# EasyEDA schematic SCH_Research-Project_2024-03-13.json
TITLE: Prototype circuits; REV: 1.0; Date: 2024-03-13; Sheet: 1/1; Drawn By: Simone; Company: Unitn
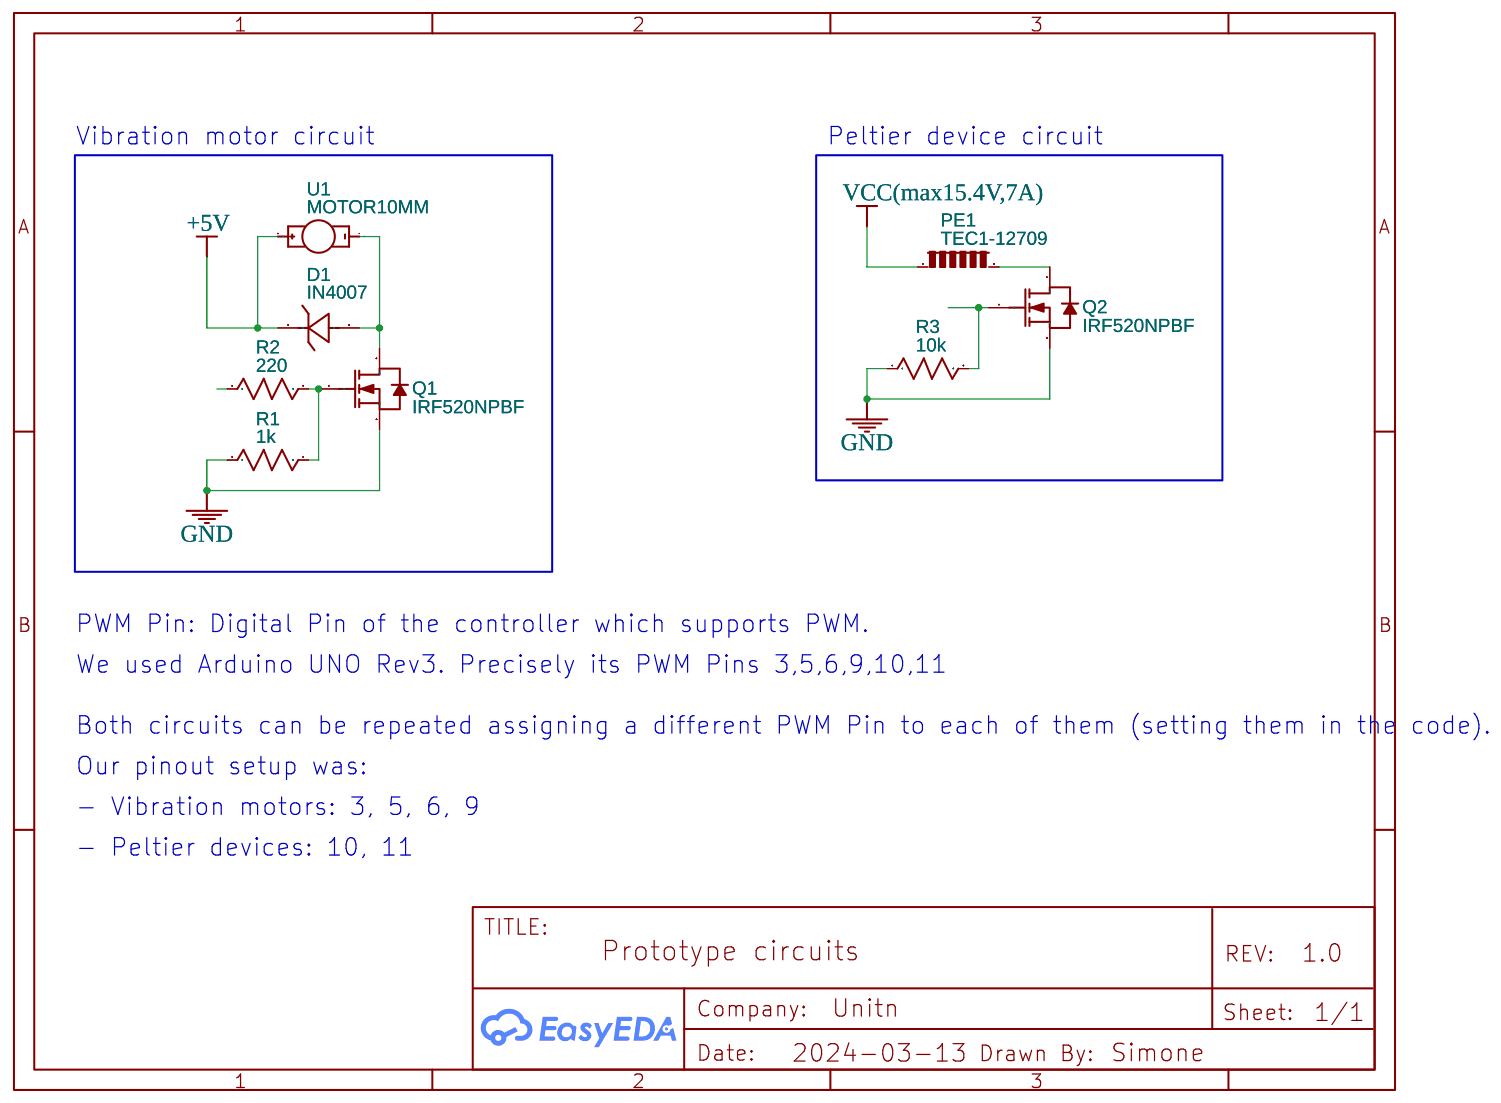
[diagram p0: schematic sheet]

## Parts
D1  IN4007  [SMA_L4.3-W2.6-LS5.1-RD]
PE1  TEC1-12709
Q1  IRF520NPBF  [TO-220-3_L10.0-W4.5-P2.54-T]
Q2  IRF520NPBF  [TO-220-3_L10.0-W4.5-P2.54-T]
R1  1k  [R0603]
R2  220  [R0603]
R3  10k  [R0603]
U1  MOTOR10MM  [VIBE-MOTOR-10MM]

## Library data of the parts
D1 = IN4007: Contributor: LCSC; Supplier: LCSC; Supplier Part: C9900004719; JLCPCB Part Class: Extended Part; Manufacturer: null
PE1 = Peltier_Element: Contributor: KiCAD; license: https://www.gnu.org/licenses/lgpl-2.1.html
Q1 Q2 = IRF520NPBF: Supplier: LCSC; Manufacturer: Infineon(英飞凌); Supplier Part: C2598; JLCPCB Part Class: Extended Part
R1-R3 = R_0603_US: Contributor: LCEDA_Lib
U1 = MOTOR10MM: Vibration Motor- ROB-08449; Contributor: SparkFun

## Nets
+5V: D1.1(C) U1.+
GND: Q1.3(S) Q2.3(S) R1.1 R3.1
VCC(max15.4V,7A): PE1.1
Net-(D1-2): D1.2(A) Q1.2(D) U1.-
Net-(PE1-2): PE1.2 Q2.2(D)
Net-(Q1-1): Q1.1(G) R1.2 R2.2
Net-(Q2-1): Q2.1(G) R3.2

Not connected (* = marked no-connect by the designer): R2 1

## Notes on the sheet
- Vibration motor circuit
- Peltier device circuit
- PWM Pin: Digital Pin of the controller which supports PWM.
- We used Arduino UNO Rev3. Precisely its PWM Pins 3,5,6,9,10,11
- Both circuits can be repeated assigning a different PWM Pin to each of them (setting them in the code).
- Our pinout setup was:
- - Vibration motors: 3, 5, 6, 9
- - Peltier devices: 10, 11
